# Altium schematic sheet main.SchDoc
size A3
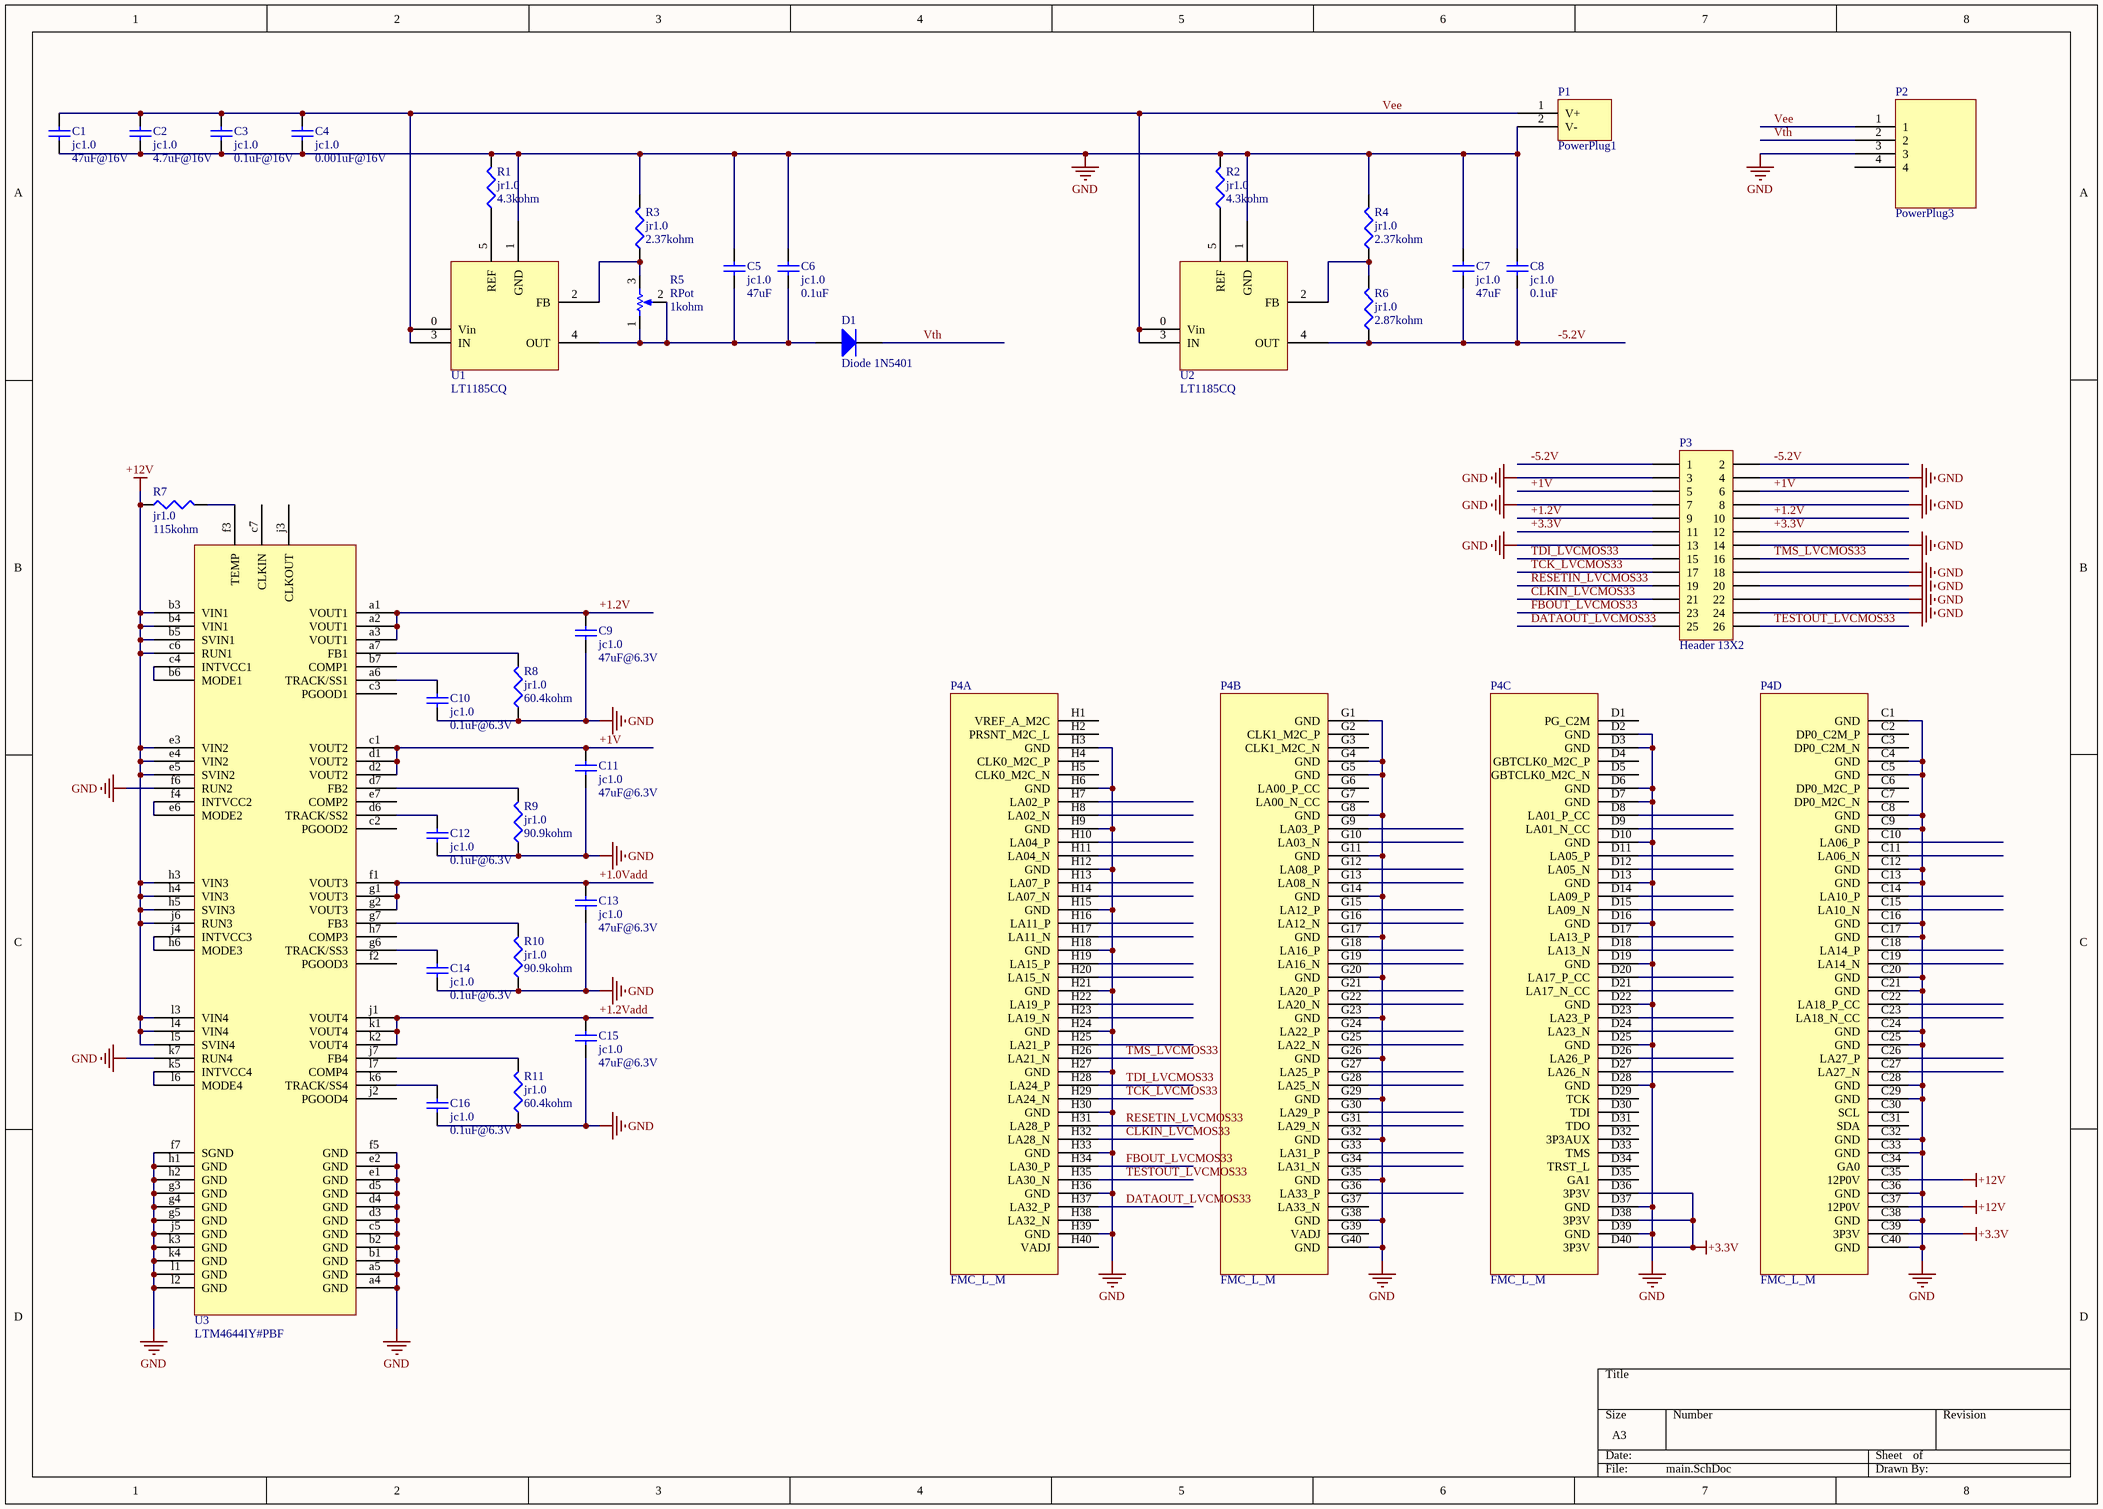
[diagram p0: main.SchDoc]

## Parts
C1  jc1.0  value 47uF@16V  [2220]
C2  jc1.0  value 4.7uF@16V  [2220]
C3  jc1.0  value 0.1uF@16V  [2220]
C4  jc1.0  value 0.001uF@16V  [2220]
C5  jc1.0  value 47uF  [2220]
C6  jc1.0  value 0.1uF  [2220]
C7  jc1.0  value 47uF  [2220]
C8  jc1.0  value 0.1uF  [2220]
C9  jc1.0  value 47uF@6.3V  [0805]
C10  jc1.0  value 0.1uF@6.3V  [0402]
C11  jc1.0  value 47uF@6.3V  [0805]
C12  jc1.0  value 0.1uF@6.3V  [0402]
C13  jc1.0  value 47uF@6.3V  [0805]
C14  jc1.0  value 0.1uF@6.3V  [0402]
C15  jc1.0  value 47uF@6.3V  [0805]
C16  jc1.0  value 0.1uF@6.3V  [0402]
D1  Diode 1N5401  [DO-201AD]
P1  PowerPlug1  [POWERPLUG1]
P2  PowerPlug3  [POWERPLUG3]
P3  Header 13X2  [HDR2X13]
P4  FMC_L_M  [ASP-134606-01]  (parts A,B,C,D of 4)
R1  jr1.0  value 4.3kohm  [0805]
R2  jr1.0  value 4.3kohm  [0805]
R3  jr1.0  value 2.37kohm  [0805]
R4  jr1.0  value 2.37kohm  [0805]
R5  RPot  value 1kohm  [VR5]
R6  jr1.0  value 2.87kohm  [0805]
R7  jr1.0  value 115kohm  [0402]
R8  jr1.0  value 60.4kohm  [0805]
R9  jr1.0  value 90.9kohm  [0805]
R10  jr1.0  value 90.9kohm  [0805]
R11  jr1.0  value 60.4kohm  [0805]
U1  LT1185CQ  [LP5 - 1185]
U2  LT1185CQ  [LP5 - 1185]
U3  LTM4644IY#PBF  [BGA77C127P7X11_900X1500X521]

## Nets
+3.3V: P3.11 P3.12 P4.C39(3P3V) P4.D36(3P3V) P4.D38(3P3V) P4.D40(3P3V)
+12V: P4.C35(12P0V) P4.C37(12P0V) R7.1 U3.b3(VIN1) U3.b4(VIN1) U3.b5(SVIN1) U3.c6(RUN1) U3.e3(VIN2) U3.e4(VIN2) U3.e5(SVIN2) U3.h3(VIN3) U3.h4(VIN3) U3.h5(SVIN3) U3.j6(RUN3) U3.l3(VIN4) U3.l4(VIN4) U3.l5(SVIN4)
GND: C1.1 C2.1 C3.1 C4.1 C5.2 C6.2 C7.2 C8.2 C9.1 C10.1 C11.1 C12.1 C13.1 C14.1 C15.1 C16.1 P1.2(V-) P2.3 P3.3 P3.4 P3.7 P3.8 P3.13 P3.14 P3.18 P3.20 P3.22 P3.24 P4.C1(GND) P4.C4(GND) P4.C5(GND) P4.C8(GND) P4.C9(GND) P4.C12(GND) P4.C13(GND) P4.C16(GND) P4.C17(GND) P4.C20(GND) P4.C21(GND) P4.C24(GND) P4.C25(GND) P4.C28(GND) P4.C29(GND) P4.C32(GND) P4.C33(GND) P4.C36(GND) P4.C38(GND) P4.C40(GND) P4.D2(GND) P4.D3(GND) P4.D6(GND) P4.D7(GND) P4.D10(GND) P4.D13(GND) P4.D16(GND) P4.D19(GND) P4.D22(GND) P4.D25(GND) P4.D28(GND) P4.D37(GND) P4.D39(GND) P4.G1(GND) P4.G4(GND) P4.G5(GND) P4.G8(GND) P4.G11(GND) P4.G14(GND) P4.G17(GND) P4.G20(GND) P4.G23(GND) P4.G26(GND) P4.G29(GND) P4.G32(GND) P4.G35(GND) P4.G38(GND) P4.G40(GND) P4.H3(GND) P4.H6(GND) P4.H9(GND) P4.H12(GND) P4.H15(GND) P4.H18(GND) P4.H21(GND) P4.H24(GND) P4.H27(GND) P4.H30(GND) P4.H33(GND) P4.H36(GND) P4.H39(GND) R1.2 R2.2 R3.2 R4.2 R8.1 R9.1 R10.1 R11.1 U1.1(GND) U2.1(GND) U3.a4(GND) U3.a5(GND) U3.b1(GND) U3.b2(GND) U3.c5(GND) U3.d3(GND) U3.d4(GND) U3.d5(GND) U3.e1(GND) U3.e2(GND) U3.f5(GND) U3.f6(RUN2) U3.f7(SGND) U3.g3(GND) U3.g4(GND) U3.g5(GND) U3.h1(GND) U3.h2(GND) U3.j5(GND) U3.k3(GND) U3.k4(GND) U3.k7(RUN4) U3.l1(GND) U3.l2(GND)
+1.0Vadd: C13.2 U3.f1(VOUT3) U3.g1(VOUT3) U3.g2(VOUT3)
+1.2V: C9.2 P3.9 P3.10 U3.a1(VOUT1) U3.a2(VOUT1) U3.a3(VOUT1)
+1.2Vadd: C15.2 U3.j1(VOUT4) U3.k1(VOUT4) U3.k2(VOUT4)
+1V: C11.2 P3.5 P3.6 U3.c1(VOUT2) U3.d1(VOUT2) U3.d2(VOUT2)
-5.2V: C7.1 C8.1 P3.1 P3.2 R6.1 U2.4(OUT)
CLKIN_LVCMOS33: P3.21 P4.H32(LA28_N)
DATAOUT_LVCMOS33: P3.25 P4.H37(LA32_P)
FBOUT_LVCMOS33: P3.23 P4.H34(LA30_P)
RESETIN_LVCMOS33: P3.19 P4.H31(LA28_P)
TCK_LVCMOS33: P3.17 P4.H29(LA24_N)
TDI_LVCMOS33: P3.15 P4.H28(LA24_P)
TESTOUT_LVCMOS33: P3.26 P4.H35(LA30_N)
TMS_LVCMOS33: P3.16 P4.H26(LA21_N)
Vee: C1.2 C2.2 C3.2 C4.2 P1.1(V+) P2.1 U1.0(Vin) U1.3(IN) U2.0(Vin) U2.3(IN)
Vth: D1.2(K) P2.2
NetC5_1: C5.1 C6.1 D1.1(A) R5.1(TOP) R5.2(TAP) U1.4(OUT)
NetC10_2: C10.2 U3.a6(TRACK/SS1)
NetC12_2: C12.2 U3.d6(TRACK/SS2)
NetC14_2: C14.2 U3.g6(TRACK/SS3)
NetC16_2: C16.2 U3.k6(TRACK/SS4)
NetR1_1: R1.1 U1.5(REF)
NetR2_1: R2.1 U2.5(REF)
NetR3_1: R3.1 R5.3(BOT) U1.2(FB)
NetR4_1: R4.1 R6.2 U2.2(FB)
NetR7_2: R7.2 U3.f3(TEMP)
NetR8_2: R8.2 U3.a7(FB1)
NetR9_2: R9.2 U3.d7(FB2)
NetR10_2: R10.2 U3.g7(FB3)
NetR11_2: R11.2 U3.j7(FB4)
NetU3_b6: U3.b6(MODE1) U3.c4(INTVCC1)
NetU3_e6: U3.e6(MODE2) U3.f4(INTVCC2)
NetU3_h6: U3.h6(MODE3) U3.j4(INTVCC3)
NetU3_k5: U3.k5(INTVCC4) U3.l6(MODE4)

Not connected (* = marked no-connect by the designer): P2 4; P4 C2(DP0_C2M_P) C3(DP0_C2M_N) C6(DP0_M2C_P) C7(DP0_M2C_N) C10(LA06_P) C11(LA06_N) C14(LA10_P) C15(LA10_N) C18(LA14_P) C19(LA14_N) C22(LA18_P_CC) C23(LA18_N_CC) C26(LA27_P) C27(LA27_N) C30(SCL) C31(SDA) C34(GA0) D1(PG_C2M) D4(GBTCLK0_M2C_P) D5(GBTCLK0_M2C_N) D8(LA01_P_CC) D9(LA01_N_CC) D11(LA05_P) D12(LA05_N) D14(LA09_P) D15(LA09_N) D17(LA13_P) D18(LA13_N) D20(LA17_P_CC) D21(LA17_N_CC) D23(LA23_P) D24(LA23_N) D26(LA26_P) D27(LA26_N) D29(TCK) D30(TDI) D31(TDO) D32(3P3AUX) D33(TMS) D34(TRST_L) D35(GA1) G2(CLK1_M2C_P) G3(CLK1_M2C_N) G6(LA00_P_CC) G7(LA00_N_CC) G9(LA03_P) G10(LA03_N) G12(LA08_P) G13(LA08_N) G15(LA12_P) G16(LA12_N) G18(LA16_P) G19(LA16_N) G21(LA20_P) G22(LA20_N) G24(LA22_P) G25(LA22_N) G27(LA25_P) G28(LA25_N) G30(LA29_P) G31(LA29_N) G33(LA31_P) G34(LA31_N) G36(LA33_P) G37(LA33_N) G39(VADJ) H1(VREF_A_M2C) H2(PRSNT_M2C_L) H4(CLK0_M2C_P) H5(CLK0_M2C_N) H7(LA02_P) H8(LA02_N) H10(LA04_P) H11(LA04_N) H13(LA07_P) H14(LA07_N) H16(LA11_P) H17(LA11_N) H19(LA15_P) H20(LA15_N) H22(LA19_P) H23(LA19_N) H25(LA21_P) H38(LA32_N) H40(VADJ); U3 b7(COMP1) c2(PGOOD2) c3(PGOOD1) c7(CLKIN) e7(COMP2) f2(PGOOD3) h7(COMP3) j2(PGOOD4) j3(CLKOUT) l7(COMP4)

## Library data of the parts
C1-C16 = Cap: Capacitor; Published: 8-Jun-2000; LatestRevisionDate: 17-Jul-2002; LatestRevisionNote: Re-released for DXP Platform.; PackageReference: RAD-0.3; Publisher: Altium Limited
D1 = Diode 1N5401: 3 Amp General Purpose Rectifier; Published: 8-Jun-2000; LatestRevisionDate: 17-Jul-2002; LatestRevisionNote: Re-released for DXP Platform.; DatasheetVersion: 1998; PackageVersion: Aug-1999; PackageReference: DO-201AD; Publisher: Altium Limited; PackageDescription: Diode, Axial; Body 9.5 x 5.6 mm (LxDia. max), Lead Dia. 1.32 mm (max); ComponentLink1Description: Manufacturer Link; ComponentLink1URL: http://www.fairchildsemi.com/; ComponentLink2Description: Datasheet; ComponentLink2URL: http://www.fairchildsemi.com/ds/1N%2F1N5400.pdf
P3 = Header 13X2: Header, 13-Pin, Dual row; LatestRevisionDate: 17-Jul-2002; LatestRevisionNote: Re-released for DXP Platform.; Publisher: Altium Limited
R1-R4 R6-R11 = Res: Resistor; Published: 8-Jun-2000; LatestRevisionDate: 04-Mar-2005; LatestRevisionNote: PCB Footprint replaced.; PackageReference: J1-0603; Publisher: Altium Limited
R5 = RPot: Potentiometer; Sim Note: Enter the Resistance value and the set point into parameter fields.; Set Position: 0.5; Published: 8-Jun-2000; LatestRevisionDate: 17-Jul-2002; LatestRevisionNote: Re-released for DXP Platform.; PackageReference: VR5; Publisher: Altium Limited